# Altium project iMX6 Rex_V1I1.PrjPcb (part 5 of 5)

## Sheet [16] - PWR 2V5, 1V5.SchDoc
size A2; DocumentNumber: 16; SheetNumber: 16; SheetTotal: 20
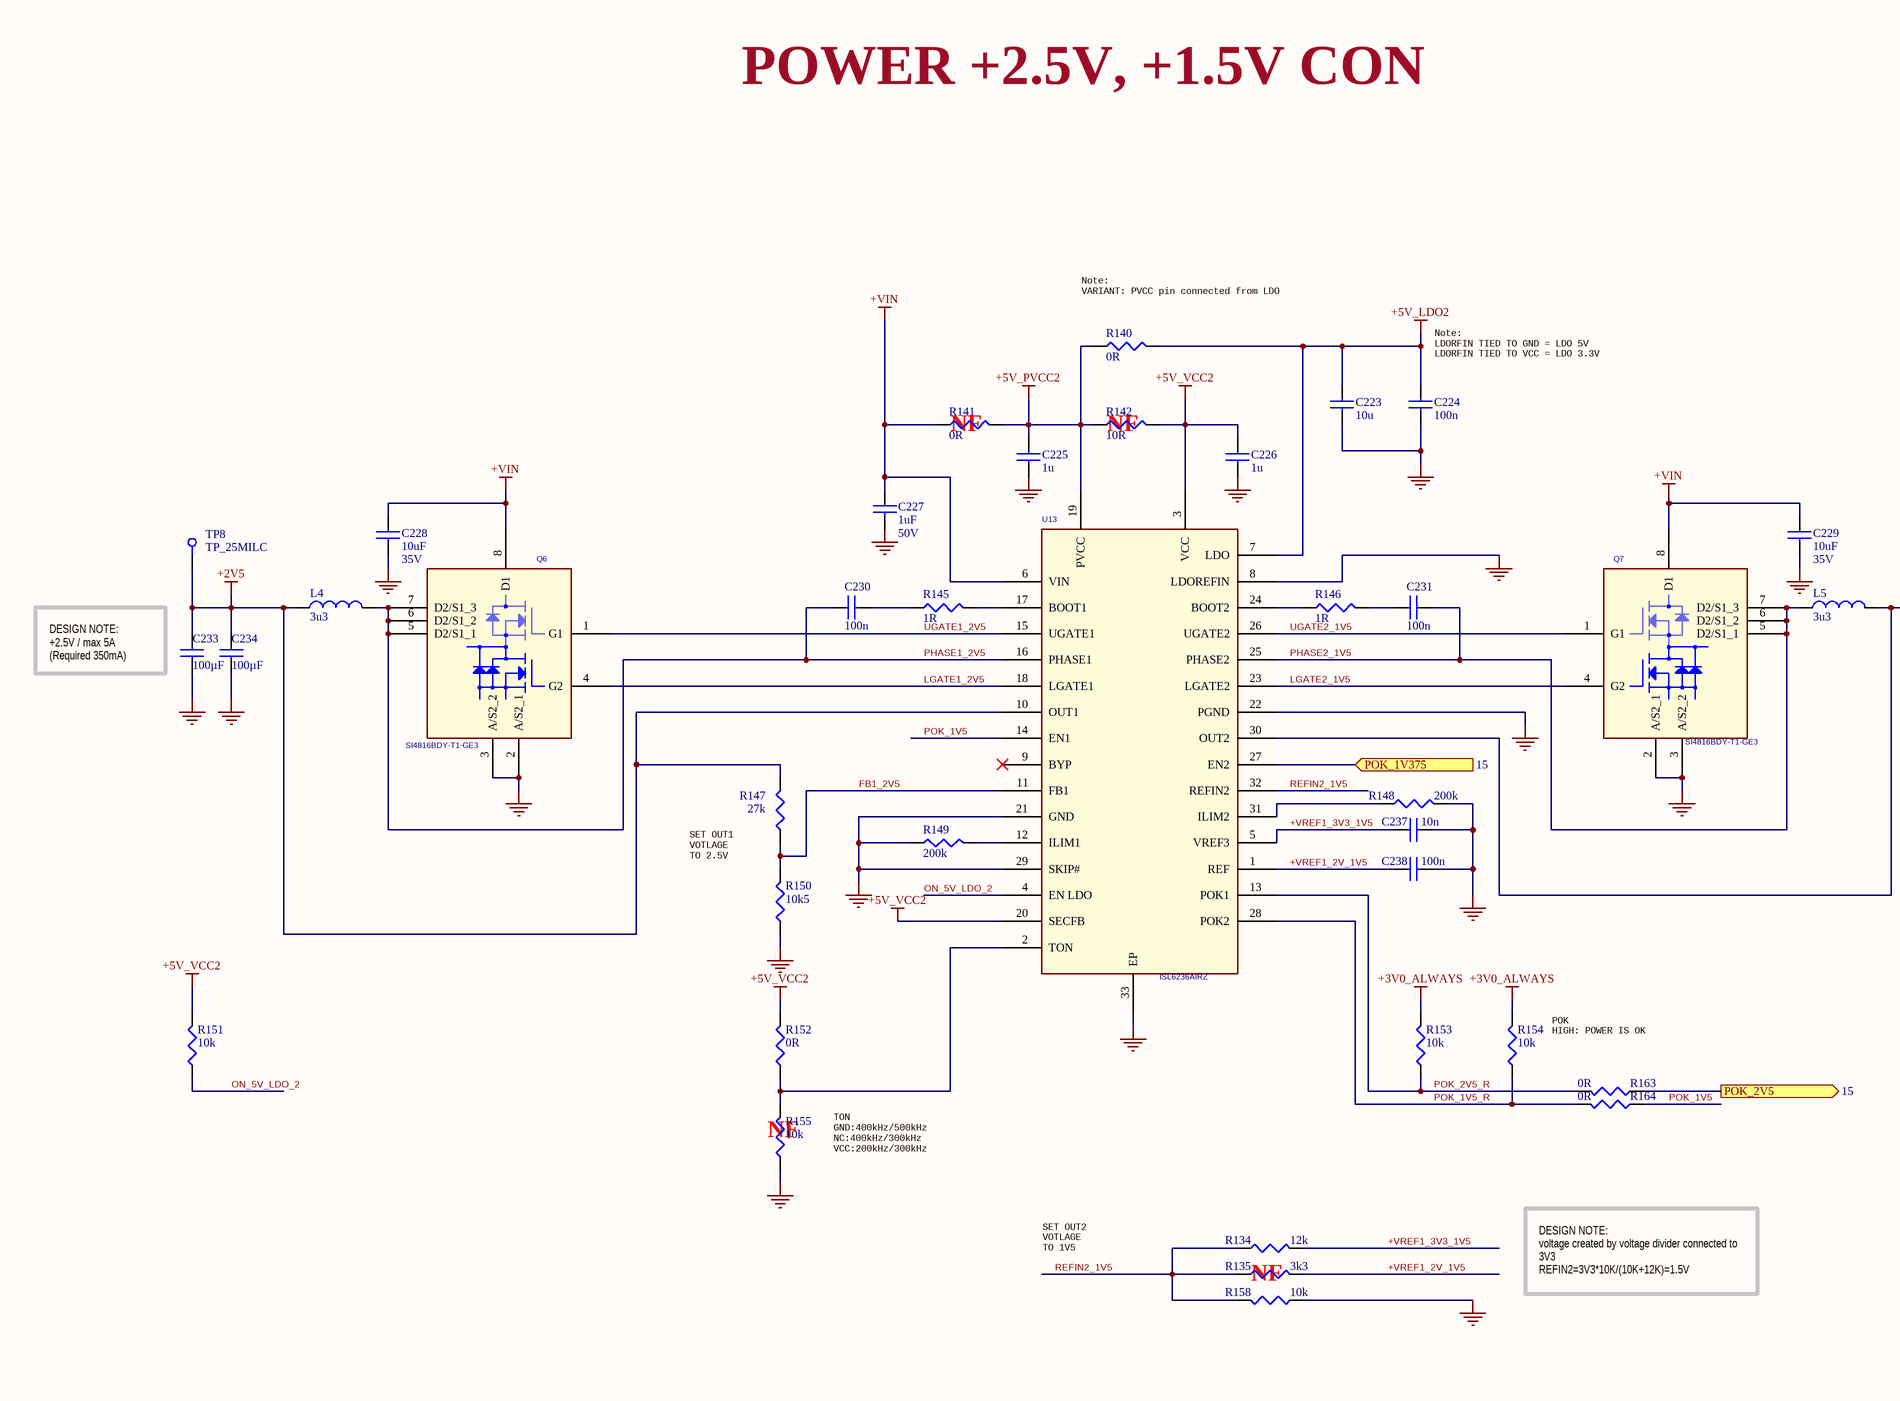
[diagram p18: [16] - PWR 2V5, 1V5.SchDoc, left]
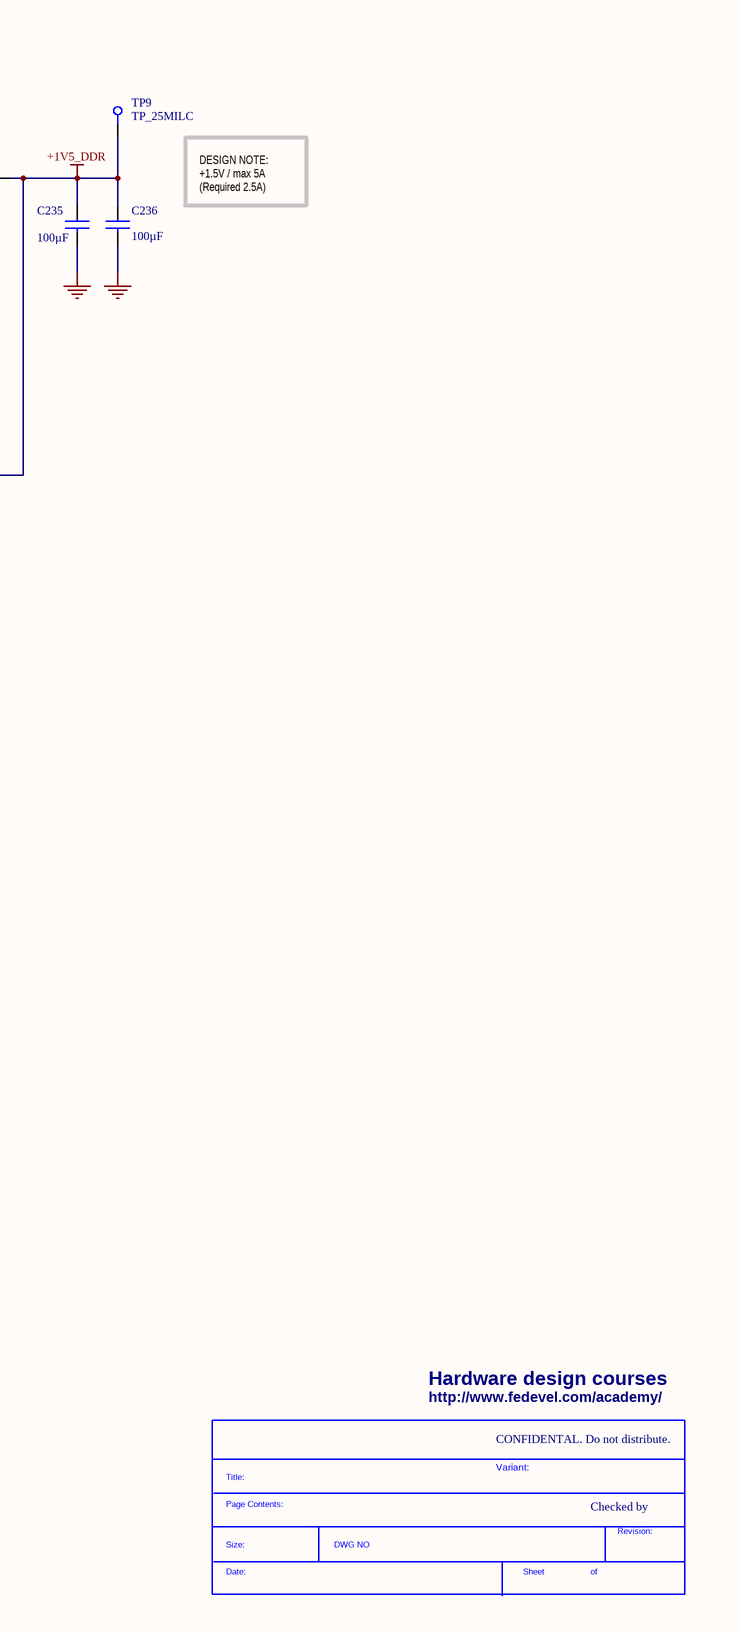
[diagram p19: [16] - PWR 2V5, 1V5.SchDoc, right]

### Parts
(Parts that share a designator on the sheet are numbered #1, #2 ... from top to bottom, then left to right.)
*#11  SDTitleBlock  (value not drawn)  (graphical)
C223  10u  [C0603]
C224  100n  [C0402]
C225  1u  [C0402]
C226  1u  [C0402]
C227  1uF  Voltage - Rated: 50V  [C0805]
C228  10uF  Voltage - Rated: 35V  [C1206]
C229  10uF  Voltage - Rated: 35V  [C1206]
C230  100n  [C0402]
C231  100n  [C0402]
C233  100µF  [C1206]
C234  100µF  [C1206]
C235  100µF  [C1206]
C236  100µF  [C1206]
C237  10n  [C0402]
C238  100n  [C0402]
L4  3u3  [IHLP_255MILx270MIL]
L5  3u3  [IHLP_255MILx270MIL]
Q6  SI4816BDY-T1-GE3  [8_SOIC_3.9MM]
Q7  SI4816BDY-T1-GE3  [8_SOIC_3.9MM]
R134  12k  [R0402]
R135  3k3  [R0402]
R140  0R  [R0402]
R141  0R  [R0402]
R142  10R  [R0402]
R145  1R  [R0402]
R146  1R  [R0402]
R147  27k  [R0402]
R148  200k  [R0402]
R149  200k  [R0402]
R150  10k5  [R0402]
R151  10k  [R0402]
R152  0R  [R0402]
R153  10k  [R0402]
R154  10k  [R0402]
R155  10k  [R0402]
R158  10k  [R0402]
R163  0R  [R0402]
R164  0R  [R0402]
TP8  TP_25MILC  [TP_25C]  (no BOM)
TP9  TP_25MILC  [TP_25C]  (no BOM)
U13  ISL6236AIRZ  [32_VFQFN_EXPOSED_PAD]

### Ports
POK_1V375 (in, see 15), POK_2V5 (out, see 15)

### Nets
+1V5_DDR: C235.1 C236.1 L5.2 TP9.1 U13.30(OUT2)
+2V5: C233.1 C234.1 L4.1 R147.2 TP8.1 U13.10(OUT1)
+3V0_ALWAYS: R153.2 R154.2
+5V_LDO2: C223.1 C224.1 R140.2 U13.7(LDO)
+5V_PVCC2: C225.1 R140.1 R141.2 R142.1 U13.19(PVCC)
+5V_VCC2: C226.1 R142.2 R151.2 R152.2 U13.3(VCC) U13.20(SECFB)
+VIN: C227.1 C228.1 C229.1 Q6.8(D1) Q7.8(D1) R141.1 U13.6(VIN)
GND: C223.2 C224.2 C225.2 C226.2 C227.2 C228.2 C229.2 C233.2 C234.2 C235.2 C236.2 C237.2 C238.2 Q6.2(A/S2_1) Q6.3(A/S2_2) Q7.2(A/S2_1) Q7.3(A/S2_2) R148.2 R149.1 R150.1 R155.1 R158.1 U13.8(LDOREFIN) U13.21(GND) U13.22(PGND) U13.29(SKIP#) U13.33(EP)
+VREF1_2V_1V5: C238.1 R135.2 U13.1(REF)
+VREF1_3V3_1V5: C237.1 R134.2 U13.5(VREF3)
FB1_2V5: R147.1 R150.2 U13.11(FB1)
LGATE1_2V5: Q6.4(G2) U13.18(LGATE1)
LGATE2_1V5: Q7.4(G2) U13.23(LGATE2)
ON_5V_LDO_2: R151.1 U13.4(EN_LDO)
PHASE1_2V5: C230.1 L4.2 Q6.5(D2/S1_1) Q6.6(D2/S1_2) Q6.7(D2/S1_3) U13.16(PHASE1)
PHASE2_1V5: C231.2 L5.1 Q7.5(D2/S1_1) Q7.6(D2/S1_2) Q7.7(D2/S1_3) U13.25(PHASE2)
POK_1V5: R164.1 U13.14(EN1)
POK_1V5_R: R154.1 R164.2 U13.28(POK2)
POK_1V375: U13.27(EN2) ; port POK_1V375
POK_2V5: R163.1 ; port POK_2V5
POK_2V5_R: R153.1 R163.2 U13.13(POK1)
REFIN2_1V5: R134.1 R135.1 R158.2 U13.32(REFIN2)
UGATE1_2V5: Q6.1(G1) U13.15(UGATE1)
UGATE2_1V5: Q7.1(G1) U13.26(UGATE2)
NetC230_2: C230.2 R145.1
NetC231_1: C231.1 R146.2
NetR145_2: R145.2 U13.17(BOOT1)
NetR146_1: R146.1 U13.24(BOOT2)
NetR148_1: R148.1 U13.31(ILIM2)
NetR149_2: R149.2 U13.12(ILIM1)
NetR152_1: R152.1 R155.2 U13.2(TON)

Not connected (* = marked no-connect by the designer): U13 9(BYP)*

### Notes on the sheet
- POWER +2.5V, +1.5V CON
- (near R140) Note:
  VARIANT: PVCC pin connected from LDO
- (near C224) Note:
  LDORFIN TIED TO GND = LDO 5V
  LDORFIN TIED TO VCC = LDO 3.3V
- (near R141) NF
- (near R142) NF
- (near C233) DESIGN NOTE:
  +2.5V / max 5A
  (Required 350mA)
- DESIGN NOTE:
  +1.5V / max 5A
  (Required 2.5A)
- SET OUT1
  VOTLAGE
  TO 2.5V
- POK
  HIGH: POWER IS OK
- (near R155) NF
- TON
  GND:400kHz/500kHz
  NC:400kHz/300kHz
  VCC:200kHz/300kHz
- SET OUT2
  VOTLAGE
  TO 1V5
- (near R135) NF
- DESIGN NOTE:
  voltage created by voltage divider connected to 3V3
  REFIN2=3V3*10K/(10K+12K)=1.5V
- Hardware design courses
- http://www.fedevel.com/academy/
- CONFIDENTAL. Do not distribute.
- Variant:
- Checked by
- (in symbol SDTitleBlock) Title:; Page Contents:; Revision:; Size:; DWG NO; Date:; Sheet; of

### Library data of the parts
C223 = C1608X5R0J106M: CAP CER 10UF 6.3V X5R 20% 0603; Manufacturer: TDK Corporation; Capacitance: 10µF; Value: 10µF; .Checked PCB: used; Description: CAP CER 10UF 6.3V 20% X5R 0603; Category: Capacitors; Manufacturer Part Number: C1608X5R0J106M; Operating Temperature: -55°C ~ 85°C; Package / Case: 0603 (1608 Metric); Price 1k [$]: 0.08580; .Checked SCH: used; Voltage - Rated: 6.3V; Features: Low ESR; Supplier Part Number: 445-4112-1-ND; Supplier: Digikey; Supplier 1: Digi-Key; Supplier Part Number 1: 445-4112-1-ND; RoHS: RoHS Compliant; Stock 1: 48157; Pricing 1: 1=0.46, 10=0.363, 100=0.1898, 250=0.14024, 500=0.1089, 1000=0.0858 (USD); Tolerance: ±20%; Temperature Coefficient: X5R; Mounting Type: Surface Mount, MLCC; Applications: General Purpose; Ratings: -; Size / Dimension: 0.063" L x 0.031" W (1.60mm x 0.80mm); Height - Seated (Max): -; Thickness (Max): 0.037" (0.95mm); Lead Spacing: -; Packaging: Cut Tape (CT); Lead Style: -; ComponentLink1URL: http://www.tdk.com/pdf/general_B11.pdf; ComponentLink1Description: http://www.tdk.com/pdf/general_B11.pdf
C224 C230 C231 C238 = C1005X5R1H104K: CAP CER .10UF 50V X5R 10% 0402; Manufacturer: TDK Corporation; Capacitance: 0.1µF; Value: 100nF; .Checked PCB: used; Description: CAP CER 0.1UF 50V 10% X5R 0402; Category: Capacitors; Manufacturer Part Number: C1005X5R1H104K; Operating Temperature: -55°C ~ 85°C; Package / Case: 0402 (1005 Metric); Price 1k [$]: 0.02340; .Checked SCH: used; Voltage - Rated: 50V; Supplier Part Number: 445-5942-1-ND; Supplier: Digikey; Supplier 1: Digi-Key; Supplier Part Number 1: 445-5942-1-ND; RoHS: RoHS Compliant; Stock 1: 106926; Pricing 1: 1=0.27, 10=0.18, 100=0.072, 250=0.05176, 500=0.0369, 1000=0.027 (USD); Tolerance: ±10%; Temperature Coefficient: X5R; Mounting Type: Surface Mount, MLCC; Applications: General Purpose; Ratings: -; Size / Dimension: 0.039" L x 0.020" W (1.00mm x 0.50mm); Height - Seated (Max): -; Thickness (Max): 0.022" (0.55mm); Lead Spacing: -; Features: -; Packaging: Cut Tape (CT); Lead Style: -; ComponentLink1URL: http://www.tdk.co.jp/tefe02/e412_c.pdf; ComponentLink1Description: http://www.tdk.co.jp/tefe02/e412_c.pdf
C225 C226 = C1005X5R1C105K: CAP CER 1.0UF 16V X5R 0402; Manufacturer: TDK Corporation; Capacitance: 1.0µF; Value: 1uF; .Checked PCB: used; Description: CAP CER 1UF 16V 10% X5R 0402; Tolerance: ±10%; Category: Capacitors; Manufacturer Part Number: C1005X5R1C105K; Operating Temperature: -55°C ~ 85°C; Package / Case: 0402 (1005 Metric); Price 1k [$]: 0.02080; .Checked SCH: used; Voltage - Rated: 16V; Supplier Part Number: 445-4978-1-ND; Supplier: Digikey; Supplier 1: Digi-Key; Supplier Part Number 1: 445-4978-1-ND; RoHS: RoHS Compliant; Stock 1: 341010; Pricing 1: 1=0.24, 10=0.16, 100=0.064, 250=0.046, 500=0.0328, 1000=0.024 (USD); Temperature Coefficient: X5R; Mounting Type: Surface Mount, MLCC; Applications: General Purpose; Ratings: -; Size / Dimension: 0.039" L x 0.020" W (1.00mm x 0.50mm); Height - Seated (Max): -; Thickness (Max): 0.022" (0.55mm); Lead Spacing: -; Features: -; Packaging: Cut Tape (CT); Lead Style: -; ComponentLink1URL: http://www.tdk.co.jp/tefe02/e412_c.pdf; ComponentLink1Description: http://www.tdk.co.jp/tefe02/e412_c.pdf
C227 = GRM21BR71H105KA12L: CAP CER 1UF 50V X7R 0805; Manufacturer: Murata Electronics North America; Capacitance: 1.0µF; .Checked PCB: used; Description: CAP CER 1UF 50V 10% X7R 0805; Tolerance: ±10%; Category: Capacitors; Manufacturer Part Number: GRM21BR71H105KA12L; Operating Temperature: -55°C ~ 125°C; Package / Case: 0805 (2012 Metric); Price 1k [$]: 0.1359; Value: 1uF; .Checked SCH: used; Supplier Part Number: 490-4736-1-ND; Supplier: Digikey; Supplier 1: Digi-Key; Supplier Part Number 1: 490-4736-1-ND; RoHS: RoHS Compliant; Stock 1: 422791; Pricing 1: 1=0.28, 10=0.254, 25=0.226, 50=0.1978, 100=0.1836, 250=0.16952, 500=0.16102, 750=0.14691, 1000=0.12995 (USD); Temperature Coefficient: X7R; Mounting Type: Surface Mount, MLCC; Applications: General Purpose; Ratings: -; Size / Dimension: 0.079" L x 0.049" W (2.00mm x 1.25mm); Height - Seated (Max): -; Thickness (Max): 0.053" (1.35mm); Lead Spacing: -; Features: -; Packaging: Cut Tape (CT); Lead Style: -; ComponentLink1URL: http://search.murata.co.jp/Ceramy/image/img/PDF/ENG/GRM21BR71H105KA12.pdf; ComponentLink1Description: http://search.murata.co.jp/Ceramy/image/img/PDF/ENG/GRM21BR71H105KA12.pdf
C228 C229 = GRM31CR6YA106KA12L: CAP CER 10UF 35V X5R 1206; Manufacturer: Murata Electronics North America; Capacitance: 10µF; .Checked PCB: used; Description: CAP CER 10UF 35V 10% X5R 1206; Tolerance: ±10%; Category: Capacitors; Manufacturer Part Number: GRM31CR6YA106KA12L; Operating Temperature: -55°C ~ 85°C; Package / Case: 1206 (3216 Metric); Price 1k [$]: 0.19448; Value: 10uF; .Checked SCH: used; Supplier Part Number: 490-5524-1-ND; Supplier: Digikey; Supplier 1: Digi-Key; Supplier Part Number 1: 490-5524-1-ND; RoHS: RoHS Compliant; Stock 1: 76334; Pricing 1: 1=0.6, 10=0.501, 50=0.359, 100=0.3142, 250=0.24684, 500=0.2244, 1000=0.17952 (USD); Temperature Coefficient: X5R; Mounting Type: Surface Mount, MLCC; Applications: General Purpose; Ratings: -; Size / Dimension: 0.126" L x 0.063" W (3.20mm x 1.60mm); Height - Seated (Max): -; Thickness (Max): 0.071" (1.80mm); Lead Spacing: -; Features: -; Packaging: Cut Tape (CT); Lead Style: -; ComponentLink1URL: http://www.murata.com/products/catalog/pdf/c02e.pdf; ComponentLink1Description: http://www.murata.com/products/catalog/pdf/c02e.pdf
C233-C236 = C3216X5R1A107M: CAP CER 100UF 10V X5R 20% 1206; Manufacturer: TDK Corporation; .Checked PCB: used; Description: CAP CER 100UF 10V 20% X5R 1206; Capacitance: 100µF; Category: Capacitors; Manufacturer Part Number: C3216X5R1A107M; Operating Temperature: -55°C ~ 85°C; Package / Case: 1206 (3216 Metric); Price 1k [$]: 0.85800; Value: 100µF; .Checked SCH: used; Voltage - Rated: 10V; Supplier Part Number: 445-6007-1-ND; Supplier: Digikey; Supplier 1: Digi-Key; Supplier Part Number 1: 445-6007-1-ND; RoHS: RoHS Compliant; Stock 1: 28026; Pricing 1: 1=1.65, 10=1.353, 100=1.089, 250=0.957, 500=0.891, 1000=0.693 (USD); Tolerance: ±20%; Temperature Coefficient: X5R; Mounting Type: Surface Mount, MLCC; Applications: General Purpose; Ratings: -; Size / Dimension: 0.126" L x 0.063" W (3.20mm x 1.60mm); Height - Seated (Max): -; Thickness (Max): 0.071" (1.80mm); Lead Spacing: -; Features: -; Packaging: Cut Tape (CT); Lead Style: -; ComponentLink1URL: http://www.tdk.com/pdf/general_B11.pdf; ComponentLink1Description: http://www.tdk.com/pdf/general_B11.pdf
C237 = C1005X7R1C103K: CAP CER 10000PF 16V X7R 10% 0402; Manufacturer: TDK Corporation; Value: 10nF; .Checked PCB: used; Description: CAP CER 10000PF 16V 10% X7R 0402; Capacitance: 10000pF; Category: Capacitors; Manufacturer Part Number: C1005X7R1C103K; Operating Temperature: -55°C ~ 125°C; Package / Case: 0402 (1005 Metric); Price 1k [$]: 0.00416; .Checked SCH: used; Voltage - Rated: 16V; Supplier Part Number: 445-1262-1-ND; Supplier: Digikey; Supplier 1: Digi-Key; Supplier Part Number 1: 445-1262-1-ND; RoHS: RoHS Compliant; Stock 1: 511497; Pricing 1: 1=0.08, 10=0.05, 100=0.018, 250=0.013, 500=0.0096, 1000=0.0065 (USD); Tolerance: ±10%; Temperature Coefficient: X7R; Mounting Type: Surface Mount, MLCC; Applications: General Purpose; Ratings: -; Size / Dimension: 0.039" L x 0.020" W (1.00mm x 0.50mm); Height - Seated (Max): -; Thickness (Max): 0.022" (0.55mm); Lead Spacing: -; Features: -; Packaging: Cut Tape (CT); Lead Style: -; ComponentLink1URL: http://www.tdk.co.jp/tefe02/e412_c.pdf; ComponentLink1Description: http://www.tdk.co.jp/tefe02/e412_c.pdf
L4 L5 = IHLP2525CZER3R3M01: INDUCTOR POWER 3.3UH 6A SMD; Manufacturer: Vishay Dale; Inductance: 3.3µH; Current - Saturation: 13.5A; Tolerance: ±20%; Shielding: Shielded; DC Resistance (DCR): 30 mOhm Max; Frequency - Test: 100kHz; .Checked PCB: RF; Supplier 1: Digi-Key; Supplier Part Number 1: 541-1009-1-ND; Manufacturer Part Number: IHLP2525CZER3R3M01; RoHS: RoHS Compliant; Category: Inductors, Coils, Chokes; Stock 1: 20795; Pricing 1: 1=2.26, 10=1.83, 100=1.525, 500=1.22, 1000=1.098 (USD); Current: 6A; Current - Temperature Rise: 6A; Type: -; Q @ Freq: -; Frequency - Self Resonant: -; Applications: General Purpose; Material - Core: -; Package / Case: 0.270" L x 0.255" W x 0.118" H (6.86mm x 6.47mm x 3.00mm); Mounting Type: Surface Mount; Packaging: Cut Tape (CT); Operating Temperature: -55°C ~ 125°C; ComponentLink1URL: http://www.vishay.com/doc?34104; ComponentLink1Description: http://www.vishay.com/doc?34104; .Checked SCH: RF
Q6 Q7 = SI4816BDY-T1-GE3: MOSFET DL N-CH 30V 6.8A 8-SOIC; Manufacturer: Vishay/Siliconix; .Checked PCB: used; FET Type: 2 N-Channel (Dual); FET Feature: Logic Level Gate; Rds On (Max) @ Id, Vgs: 18.5 mOhm @ 6.8A, 10V; Current - Continuous Drain (Id) @ 25° C: 5.8A, 8.2A; Vgs(th) (Max) @ Id: 3V @ 250µA; Power - Max: 1W, 1.25W; Gate Charge (Qg) @ Vgs: 10nC @ 5V; .Checked SCH: used; Category: Discrete Semiconductor Products; Manufacturer Part Number: SI4816BDY-T1-GE3; Package / Case: 8-SOIC (0.154", 3.90mm Width); Price 1k [$]: 0.84800; Value: SI4816BDY-T1-GE3; Family: FETs - Arrays; Drain to Source Voltage (Vdss): 30V; Supplier Part Number: SI4816BDY-T1-GE3CT-ND; Supplier: Digikey; Supplier 1: Digi-Key; Supplier Part Number 1: SI4816BDY-T1-GE3CT-ND; RoHS: RoHS Compliant; Stock 1: 15735; Pricing 1: 1=1.84, 25=1.4228, 100=1.2912, 250=1.1594, 500=1.0013, 1000=0.8432 (USD); Input Capacitance (Ciss) @ Vds: -; Mounting Type: Surface Mount; Supplier Device Package: 8-SOICN; Packaging: Cut Tape (CT); ComponentLink1URL: http://www.vishay.com/docs/73026/si4816bd.pdf; ComponentLink1Description: http://www.vishay.com/docs/73026/si4816bd.pdf
R134 = RC0402FR-0712KL: RES 12.0K OHM 1/16W 1% 0402 SMD; Manufacturer: Yageo; Power (Watts): 0.063W, 1/16W; .Checked PCB: used; Temperature Coefficient: ±100ppm/°C; Category: Resistors; Supplier Part Number: 311-12.0KLRCT-ND; Manufacturer Part Number: RC0402FR-0712KL; Package / Case: 0402 (1005 Metric); Price 1k [$]: 0.01421; Resistance (Ohms): 12K; Tolerance: ±1%; Value: 12k; .Checked SCH: used; Supplier: Digikey; Supplier 1: Digi-Key; Supplier Part Number 1: 311-12.0KLRCT-ND; RoHS: RoHS Compliant; Stock 1: 526086; Pricing 1: 10=0.014, 50=0.0104, 100=0.0079, 250=0.00584, 500=0.00432, 1000=0.00288 (USD); Composition: Thick Film; Features: -; Size / Dimension: 0.039" L x 0.020" W (1.00mm x 0.50mm); Height: 0.016" (0.40mm); Number of Terminations: 2; Packaging: Cut Tape (CT); ComponentLink1URL: http://www.yageo.com/documents/recent/PYu-RC0402_51_RoHS_L_6.pdf; ComponentLink1Description: http://www.yageo.com/documents/recent/PYu-RC0402_51_RoHS_L_6.pdf
R135 = RC0402FR-073K3L: RES 3.30K OHM 1/16W 1% 0402 SMD; Manufacturer: Yageo; Resistance (Ohms): 3.3K; Power (Watts): 0.063W, 1/16W; .Checked PCB: used; Temperature Coefficient: ±100ppm/°C; Category: Resistors; Supplier Part Number: 311-3.30KLRCT-ND; Manufacturer Part Number: RC0402FR-073K3L; Package / Case: 0402 (1005 Metric); Price 1k [$]: 0.01421; Tolerance: ±1%; Value: 3k3; .Checked SCH: used; Supplier: Digikey; Supplier 1: Digi-Key; Supplier Part Number 1: 311-3.30KLRCT-ND; RoHS: RoHS Compliant; Stock 1: 356340; Pricing 1: 10=0.014, 50=0.0104, 100=0.0079, 250=0.00584, 500=0.00432, 1000=0.00288 (USD); Composition: Thick Film; Features: -; Size / Dimension: 0.039" L x 0.020" W (1.00mm x 0.50mm); Height: 0.016" (0.40mm); Number of Terminations: 2; Packaging: Cut Tape (CT); ComponentLink1URL: http://www.yageo.com/documents/recent/PYu-RC0402_51_RoHS_L_6.pdf; ComponentLink1Description: http://www.yageo.com/documents/recent/PYu-RC0402_51_RoHS_L_6.pdf
R140 R141 R152 R163 R164 = RC0402JR-070RL: RES 0.0 OHM 1/16W 0402 SMD; Manufacturer: Yageo; Resistance (Ohms): 0.0; Power (Watts): 0.063W, 1/16W; Tolerance: Jumper; .Checked PCB: used; Category: Resistors; Manufacturer Part Number: RC0402JR-070RL; Package / Case: 0402 (1005 Metric); Price 1k [$]: 0.01389; Value: 0R; .Checked SCH: used; Supplier Part Number: 311-0.0JRCT-ND; Supplier: Digikey; Supplier 1: Digi-Key; Supplier Part Number 1: 311-0.0JRCT-ND; RoHS: RoHS Compliant; Stock 1: 1106330; Pricing 1: 10=0.012, 50=0.009, 100=0.0069, 250=0.00512, 500=0.0038, 1000=0.00253 (USD); Composition: Thick Film; Features: -; Temperature Coefficient: -; Size / Dimension: 0.039" L x 0.020" W (1.00mm x 0.50mm); Height: 0.016" (0.40mm); Number of Terminations: 2; Packaging: Cut Tape (CT); ComponentLink1URL: http://www.yageo.com/documents/recent/PYu-RC0402_51_RoHS_L_6.pdf; ComponentLink1Description: http://www.yageo.com/documents/recent/PYu-RC0402_51_RoHS_L_6.pdf
R142 = RC0402FR-0710RL: RES 10.0 OHM 1/16W 1% 0402 SMD; Manufacturer: Yageo; Resistance (Ohms): 10; Power (Watts): 0.063W, 1/16W; .Checked PCB: used; Temperature Coefficient: ±200ppm/°C; Category: Resistors; Manufacturer Part Number: RC0402FR-0710RL; Package / Case: 0402 (1005 Metric); Price 1k [$]: 0.01421; Tolerance: ±1%; Value: 10R; .Checked SCH: used; Supplier Part Number: 311-10.0LRCT-ND; Supplier: Digikey; Supplier 1: Digi-Key; Supplier Part Number 1: 311-10.0LRCT-ND; RoHS: RoHS Compliant; Stock 1: 681416; Pricing 1: 10=0.014, 50=0.0104, 100=0.0079, 250=0.00584, 500=0.00432, 1000=0.00288 (USD); Composition: Thick Film; Features: -; Size / Dimension: 0.039" L x 0.020" W (1.00mm x 0.50mm); Height: 0.016" (0.40mm); Number of Terminations: 2; Packaging: Cut Tape (CT); ComponentLink1URL: http://www.yageo.com/documents/recent/PYu-RC0402_51_RoHS_L_6.pdf; ComponentLink1Description: http://www.yageo.com/documents/recent/PYu-RC0402_51_RoHS_L_6.pdf
R145 R146 = RC0402FR-071RL: RES 1.00 OHM 1/16W 1% 0402 SM; Manufacturer: Yageo; Resistance (Ohms): 1; Power (Watts): 0.063W, 1/16W; .Checked PCB: used; Description: RES 1.00 OHM 1/16W 1% 0402 SMD; Temperature Coefficient: ±200ppm/°C; Category: Resistors; Manufacturer Part Number: RC0402FR-071RL; Package / Case: 0402 (1005 Metric); Price 1k [$]: 0.01421; Tolerance: ±1%; Value: 1R; .Checked SCH: used; Supplier Part Number: 311-1.00LRCT-ND; Supplier: Digikey; Supplier 1: Digi-Key; Supplier Part Number 1: 311-1.00LRCT-ND; RoHS: RoHS Compliant; Stock 1: 347765; Pricing 1: 10=0.019, 50=0.0142, 100=0.0109, 250=0.00808, 500=0.00596, 1000=0.00397 (USD); Composition: Thick Film; Features: -; Size / Dimension: 0.039" L x 0.020" W (1.00mm x 0.50mm); Height: 0.016" (0.40mm); Number of Terminations: 2; Packaging: Cut Tape (CT); ComponentLink1URL: http://www.yageo.com/documents/recent/PYu-RC0402_51_RoHS_L_6.pdf; ComponentLink1Description: http://www.yageo.com/documents/recent/PYu-RC0402_51_RoHS_L_6.pdf
R147 = RC0402FR-0727KL: RES 27.0K OHM 1/16W 1% 0402 SMD; Manufacturer: Yageo; Power (Watts): 0.063W, 1/16W; .Checked PCB: RF; Temperature Coefficient: ±100ppm/°C; Category: Resistors; Supplier Part Number: 311-27.0KLRCT-ND; Manufacturer Part Number: RC0402FR-0727KL; Package / Case: 0402 (1005 Metric); Price 1k [$]: 0.00288; Resistance (Ohms): 27K; Tolerance: ±1%; Value: 27k; .Checked SCH: RF; Supplier: Digikey; Supplier 1: Digi-Key; Supplier Part Number 1: 311-27.0KLRCT-ND; RoHS: RoHS Compliant; Stock 1: 21638; Pricing 1: 10=0.014, 50=0.0104, 100=0.0079, 250=0.00584, 500=0.00432, 1000=0.00288 (USD); Composition: Thick Film; Features: -; Size / Dimension: 0.039" L x 0.020" W (1.00mm x 0.50mm); Height: 0.016" (0.40mm); Number of Terminations: 2; Packaging: Cut Tape (CT); ComponentLink1URL: http://www.yageo.com/documents/recent/PYu-RC0402_51_RoHS_L_6.pdf; ComponentLink1Description: http://www.yageo.com/documents/recent/PYu-RC0402_51_RoHS_L_6.pdf
R148 R149 = RC0402FR-07200KL: RES 200K OHM 1/16W 1% 0402 SMD; Manufacturer: Yageo; Power (Watts): 0.063W, 1/16W; .Checked PCB: used; Temperature Coefficient: ±100ppm/°C; Category: Resistors; Manufacturer Part Number: RC0402FR-07200KL; Package / Case: 0402 (1005 Metric); Price 1k [$]: 0.01421; Resistance (Ohms): 200K; Tolerance: ±1%; Value: 200k; .Checked SCH: used; Supplier Part Number: 311-200KLRCT-ND; Supplier: Digikey; Supplier 1: Digi-Key; Supplier Part Number 1: 311-200KLRCT-ND; RoHS: RoHS Compliant; Stock 1: 225869; Pricing 1: 10=0.014, 50=0.0104, 100=0.0079, 250=0.00584, 500=0.00432, 1000=0.00288 (USD); Composition: Thick Film; Features: -; Size / Dimension: 0.039" L x 0.020" W (1.00mm x 0.50mm); Height: 0.016" (0.40mm); Number of Terminations: 2; Packaging: Cut Tape (CT); ComponentLink1URL: http://www.yageo.com/documents/recent/PYu-RC0402_51_RoHS_L_6.pdf; ComponentLink1Description: http://www.yageo.com/documents/recent/PYu-RC0402_51_RoHS_L_6.pdf
R150 = CRCW040210K5FKED: RES 10.5K OHM 1/16W 1% 0402 SMD; Manufacturer: Vishay/Dale; Power (Watts): 0.063W, 1/16W; .Checked PCB: used; Temperature Coefficient: ±100ppm/°C; Category: Resistors; Manufacturer Part Number: CRCW040210K5FKED; Package / Case: 0402 (1005 Metric); Price 1k [$]: 0.01740; Resistance (Ohms): 10.5K; Tolerance: ±1%; Value: 10k5; .Checked SCH: used; Supplier Part Number: 541-10.5KLCT-ND; Supplier: Digikey; Supplier 1: Digi-Key; Supplier Part Number 1: 541-10.5KLCT-ND; RoHS: RoHS Compliant; Stock 1: 36157; Pricing 1: 10=0.083, 50=0.0444, 200=0.0255, 1000=0.0174 (USD); Composition: Thick Film; Features: -; Size / Dimension: 0.039" L x 0.020" W (1.00mm x 0.50mm); Height: 0.016" (0.40mm); Number of Terminations: 2; Packaging: Cut Tape (CT); ComponentLink1URL: http://www.vishay.com/doc?20035; ComponentLink1Description: http://www.vishay.com/doc?20035
R151 R153-R155 R158 = RC0402FR-0710KL: RES 10.0K OHM 1/16W 1% 0402 SMD; Manufacturer: Yageo; Power (Watts): 0.063W, 1/16W; .Checked PCB: used; Temperature Coefficient: ±100ppm/°C; Category: Resistors; Manufacturer Part Number: RC0402FR-0710KL; Package / Case: 0402 (1005 Metric); Price 1k [$]: 0.01421; Resistance (Ohms): 10K; Tolerance: ±1%; Value: 10k; .Checked SCH: used; Supplier Part Number: 311-10.0KLRCT-ND; Supplier: Digikey; Supplier 1: Digi-Key; Supplier Part Number 1: 311-10.0KLRCT-ND; RoHS: RoHS Compliant; Stock 1: 2916495; Pricing 1: 10=0.014, 50=0.0104, 100=0.0079, 250=0.00584, 500=0.00432, 1000=0.00288 (USD); Composition: Thick Film; Features: -; Size / Dimension: 0.039" L x 0.020" W (1.00mm x 0.50mm); Height: 0.016" (0.40mm); Number of Terminations: 2; Packaging: Cut Tape (CT); ComponentLink1URL: http://www.yageo.com/documents/recent/PYu-RC0402_51_RoHS_L_6.pdf; ComponentLink1Description: http://www.yageo.com/documents/recent/PYu-RC0402_51_RoHS_L_6.pdf
TP8 TP9 = TP_25MILC: Test Point 25mil
U13 = ISL6236AIRZ: IC MAIN PWR CTRLR QUAD 32-QFN; Manufacturer: Intersil; .Checked PCB: used; Voltage - Input: 4.5 V ~ 25 V; Number of Outputs: 4; Voltage - Output: Multiple; .Checked SCH: used; Category: Integrated Circuits (ICs); Manufacturer Part Number: ISL6236AIRZ; Operating Temperature: -40°C ~ 100°C; Package / Case: 32-VFQFN Exposed Pad; Price 1k [$]: 3.0840; Value: ISL6236AIRZ; Family: PMIC - Voltage Regulators - Special Purpose; Supplier Part Number: ISL6236AIRZ-ND; Supplier: Digikey; Supplier 1: Digi-Key; Supplier Part Number 1: ISL6236AIRZ-ND; RoHS: RoHS Compliant; Stock 1: 0; Pricing 1: 600=4.28 (USD); Applications: Controller, Notebook Power System; Mounting Type: Surface Mount; Supplier Device Package: 32-QFN Exposed Pad (5x5); Packaging: Tube; ComponentLink1URL: http://www.intersil.com/data/fn/fn6453.pdf; ComponentLink1Description: http://www.intersil.com/data/fn/fn6453.pdf

## Sheet [17] - MECH.SchDoc
size A2; DocumentNumber: 17; SheetNumber: 17; SheetTotal: 20
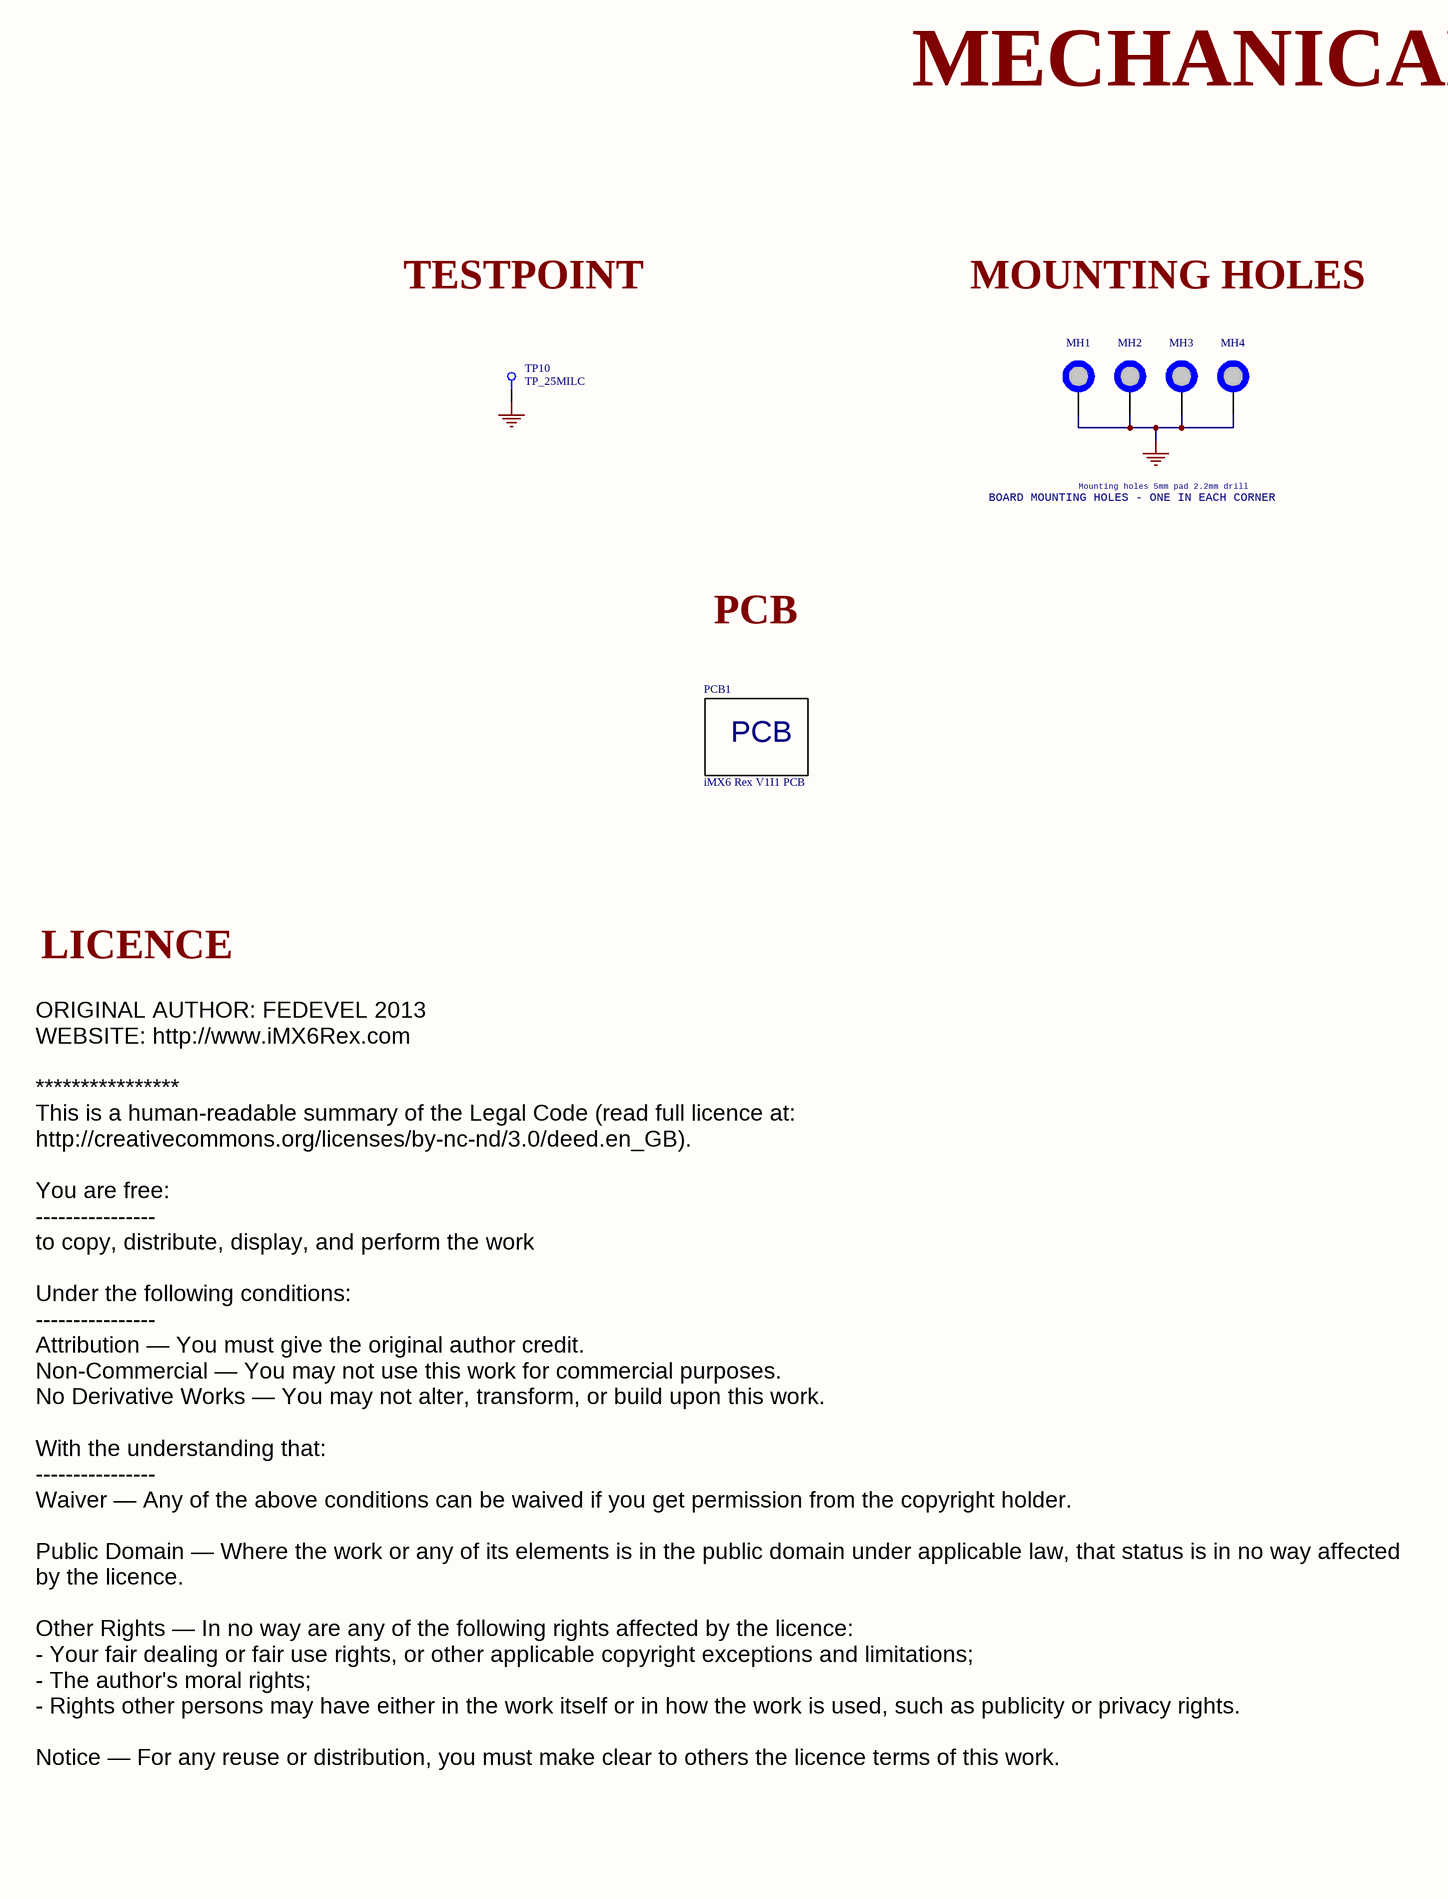
[diagram p20: [17] - MECH.SchDoc, left]
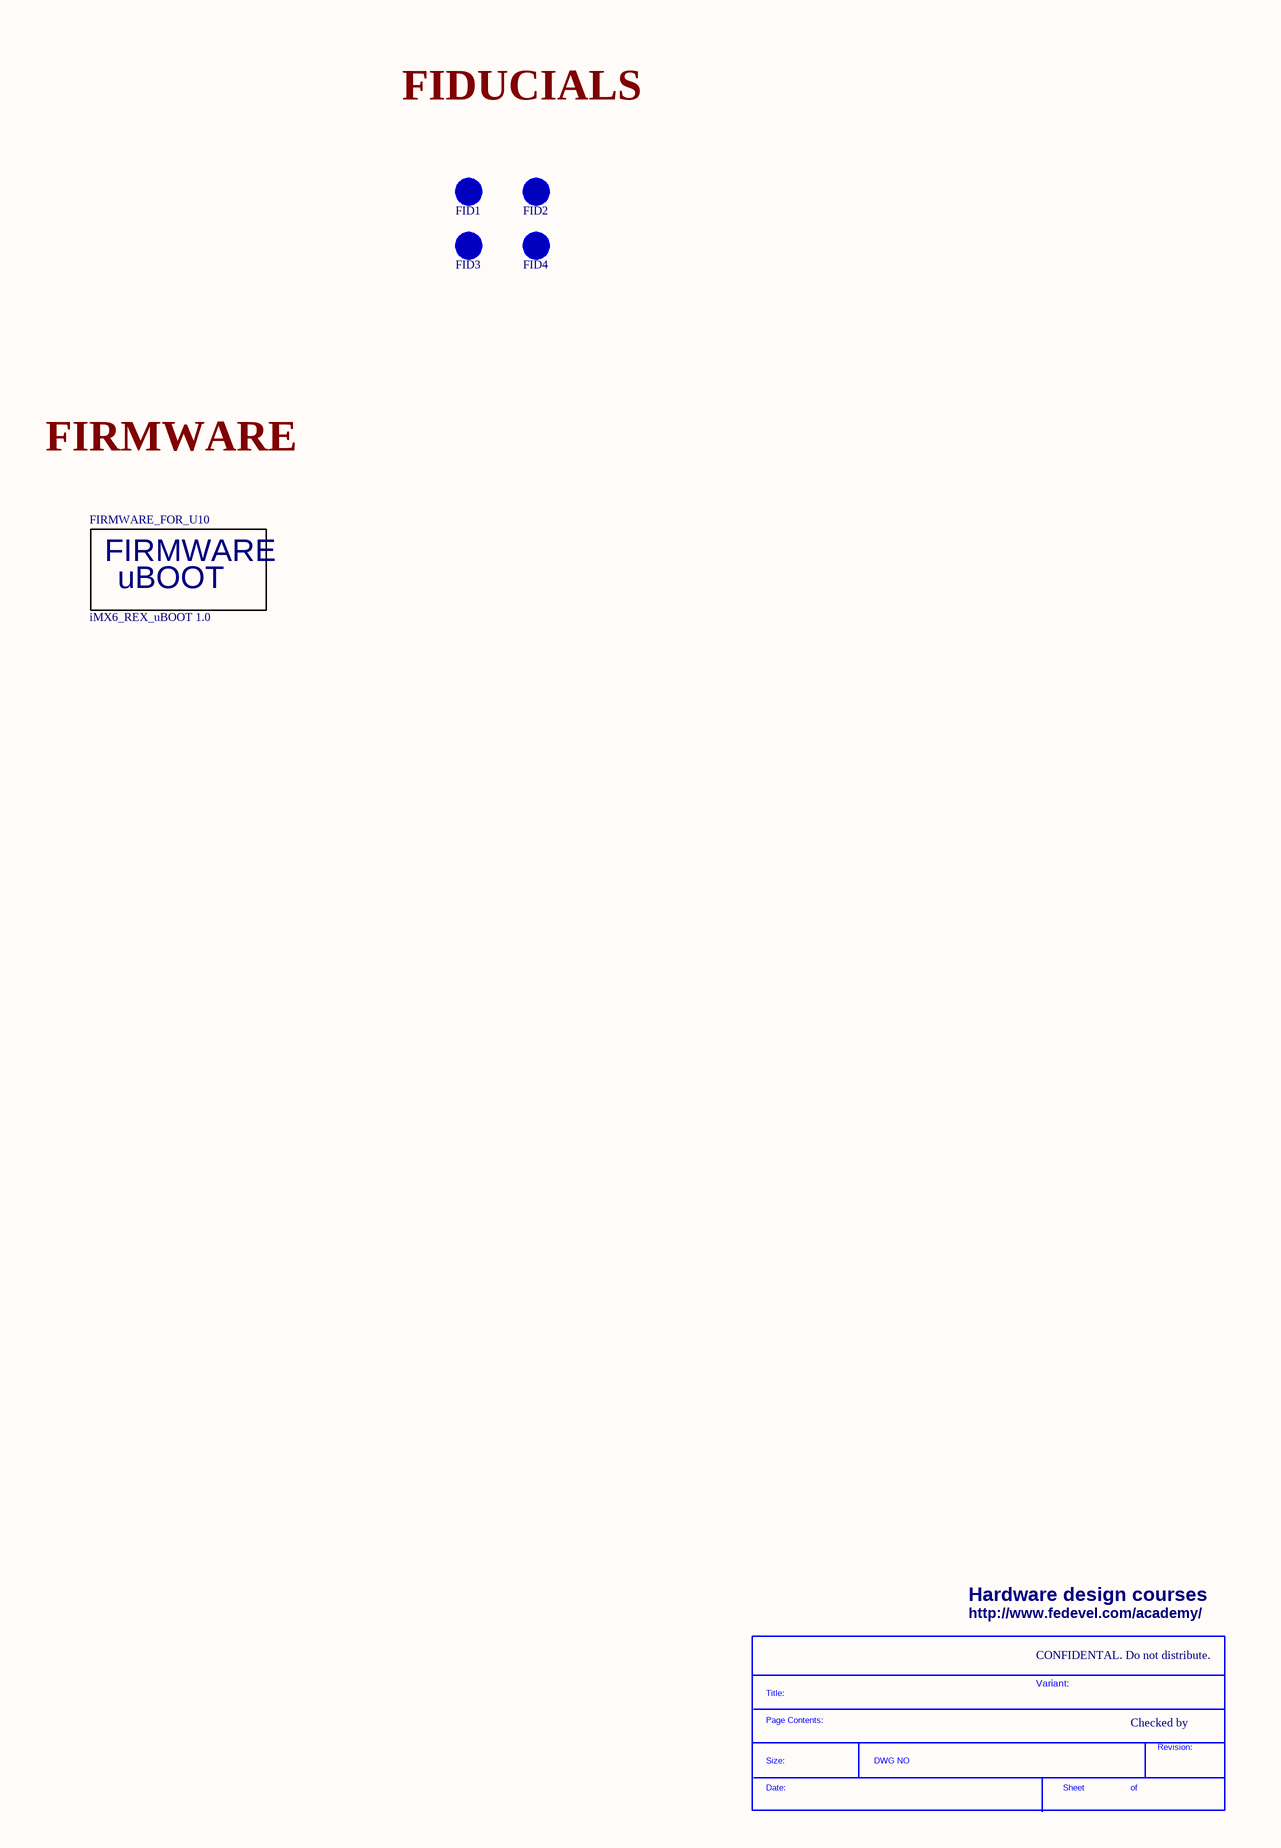
[diagram p21: [17] - MECH.SchDoc, right]

### Parts
(Parts that share a designator on the sheet are numbered #1, #2 ... from top to bottom, then left to right.)
*#12  SDTitleBlock  (value not drawn)  (graphical)
FID1  FID_1MM_SMALL  [FID_40X52D]  (value not drawn)  (no BOM)
FID2  FID_1MM_SMALL  [FID_40X52D]  (value not drawn)  (no BOM)
FID3  FID_1MM_SMALL  [FID_40X52D]  (value not drawn)  (no BOM)
FID4  FID_1MM_SMALL  [FID_40X52D]  (value not drawn)  (no BOM)
FIRMWARE_FOR_U10  iMX6_REX_uBOOT 1.0  (mechanical)
MH1  MH_5MMC_2.2MMD  [MH_5MMD_2.2MMD]  (value not drawn)  (no BOM)
MH2  MH_5MMC_2.2MMD  [MH_5MMD_2.2MMD]  (value not drawn)  (no BOM)
MH3  MH_5MMC_2.2MMD  [MH_5MMD_2.2MMD]  (value not drawn)  (no BOM)
MH4  MH_5MMC_2.2MMD  [MH_5MMD_2.2MMD]  (value not drawn)  (no BOM)
PCB1  iMX6 Rex V1I1 PCB  (mechanical)
TP10  TP_25MILC  [TP_25C]  (no BOM)

### Nets
GND: MH1.1 MH2.1 MH3.1 MH4.1 TP10.1

### Notes on the sheet
- MECHANICAL
- TESTPOINT
- MOUNTING HOLES
- FIDUCIALS
- BOARD MOUNTING HOLES - ONE IN EACH CORNER
- Mounting holes 5mm pad 2.2mm drill
- PCB
- FIRMWARE
- LICENCE
- Hardware design courses
- http://www.fedevel.com/academy/
- CONFIDENTAL. Do not distribute.
- ORIGINAL AUTHOR: FEDEVEL 2013
  WEBSITE: http://www.iMX6Rex.com
  ****************
  This is a human-readable summary of the Legal Code (read full licence at:
  http://creativecommons.org/licenses/by-nc-nd/3.0/deed.en_GB).
  You are free:
  ----------------
  to copy, distribute, display, and perform the work
  Under the following conditions:
  ----------------
  Attribution — You must give the original author credit.
  Non-Commercial — You may not use this work for commercial purposes.
  No Derivative Works — You may not alter, transform, or build upon this work.
  With the understanding that:
  ----------------
  Waiver — Any of the above conditions can be waived if you get permission from the copyright holder.
  Public Domain — Where the work or any of its elements is in the public domain under applicable law, that status is in no way affected by the licence.
  Other Rights — In no way are any of the following rights affected by the licence:
  - Your fair dealing or fair use rights, or other applicable copyright exceptions and limitations;
  - The author's moral rights;
  - Rights other persons may have either in the work itself or in how the work is used, such as publicity or privacy rights.
  Notice — For any reuse or distribution, you must make clear to others the licence terms of this work.
- Variant:
- Checked by
- (in symbol FIRMWARE_iMX6_Rex_uBOOT 1.0) FIRMWARE; uBOOT
- (in symbol PCB_iMX6_REX_V1I1) PCB
- (in symbol SDTitleBlock) Title:; Page Contents:; Revision:; Size:; DWG NO; Date:; Sheet; of

### Library data of the parts
FID1-FID4 = FID_1MM_SMALL: Fiducial 40mil Diameter, 52mil Mask; Supplier: Digikey
FIRMWARE_FOR_U10 = FIRMWARE_iMX6_Rex_uBOOT 1.0: .Creator: MM; Category: Firmware
MH1-MH4 = MH_5MMC_2.2MMD: Mounting Hole 5mm Diameter, 2.2mm Drill
PCB1 = PCB_iMX6_REX_V1I1: Printed Circuit Board; .Creator: MM; Category: Printed circuits board
TP10 = TP_25MILC: Test Point 25mil

## Nets that join several sheets
+1V1_VDDSOC_CAP: [05] - CPU - PCIE, SATA (C78.1 FB1.1 R13.1 R18.1), [06] - CPU - HDMI, LVDS (C246.1 R23.1), [11] - CPU - POWER (16 pins)
+1V2_ETH: [11] - CPU - POWER (R105.2), [13] - ETHERNET PHY (11 pins)
+1V5_DDR: [10] - CPU - JTAG, CONTROL (R59.2), [11] - CPU - POWER (13 pins), [16] - PWR 2V5, 1V5 (5 pins)
+1V375: [11] - CPU - POWER (30 pins), [13] - ETHERNET PHY (FB8.2), [15] - PWR 3V3, 1V375 (6 pins)
+2V5: [05] - CPU - PCIE, SATA (C244.1 C245.1 R14.1 R19.1), [06] - CPU - HDMI, LVDS (C247.1 R27.1 R34.1), [11] - CPU - POWER (C153.1 R74.2 R78.2 R80.2), [13] - ETHERNET PHY (FB6.1), [16] - PWR 2V5, 1V5 (6 pins)
+3V0_ALWAYS: [10] - CPU - JTAG, CONTROL (9 pins), [11] - CPU - POWER (6 pins), [15] - PWR 3V3, 1V375 (8 pins), [16] - PWR 2V5, 1V5 (R153.2 R154.2)
+3V3: [06] - CPU - HDMI, LVDS (7 pins), [08] - CPU - SPI, I2C, SD, MMC (8 pins), [03] - CONNECTORS (C1.1 J2.50), [10] - CPU - JTAG, CONTROL (10 pins), [11] - CPU - POWER (21 pins), [13] - ETHERNET PHY (C177.1 FB7.1 U9.1), [15] - PWR 3V3, 1V375 (8 pins)
+VIN: [03] - CONNECTORS (9 pins), [15] - PWR 3V3, 1V375 (10 pins), [16] - PWR 2V5, 1V5 (7 pins)
GND: [05] - CPU - PCIE, SATA (12 pins), [06] - CPU - HDMI, LVDS (9 pins), [03] - CONNECTORS (16 pins), [10] - CPU - JTAG, CONTROL (18 pins), [11] - CPU - POWER (195 pins), [13] - ETHERNET PHY (39 pins), [15] - PWR 3V3, 1V375 (39 pins), [16] - PWR 2V5, 1V5 (27 pins), [17] - MECH (5 pins)
BOOT_MODE: [03] - CONNECTORS (J1.50), [10] - CPU - JTAG, CONTROL (Q9.1 R165.1)
CLK1_N: [05] - CPU - PCIE, SATA (C66.2 R17.2), [03] - CONNECTORS (J2.46)
CLK1_P: [05] - CPU - PCIE, SATA (C67.2 R16.2), [03] - CONNECTORS (J2.48)
CSPI2_CLK: [08] - CPU - SPI, I2C, SD, MMC (R159.2), [03] - CONNECTORS (J1.17)
CSPI2_CS0: [08] - CPU - SPI, I2C, SD, MMC (U1.V25), [03] - CONNECTORS (J1.19)
CSPI2_MISO: [08] - CPU - SPI, I2C, SD, MMC (U1.U24), [03] - CONNECTORS (J1.21)
CSPI2_MOSI: [08] - CPU - SPI, I2C, SD, MMC (U1.T21), [03] - CONNECTORS (J1.23)
ENET_LED_LINK: [03] - CONNECTORS (J1.56), [13] - ETHERNET PHY (R81.2)
ENET_LED_RX: [03] - CONNECTORS (J1.55), [13] - ETHERNET PHY (R82.2)
HDMI_CEC_IN: [06] - CPU - HDMI, LVDS (R22.1 R24.2 R25.2), [03] - CONNECTORS (J1.44)
HDMI_CLK_N: [06] - CPU - HDMI, LVDS (U1.J5), [03] - CONNECTORS (J1.45)
HDMI_CLK_P: [06] - CPU - HDMI, LVDS (U1.J6), [03] - CONNECTORS (J1.47)
HDMI_D0_N: [06] - CPU - HDMI, LVDS (U1.K5), [03] - CONNECTORS (J1.39)
HDMI_D0_P: [06] - CPU - HDMI, LVDS (U1.K6), [03] - CONNECTORS (J1.41)
HDMI_D1_N: [06] - CPU - HDMI, LVDS (U1.J3), [03] - CONNECTORS (J1.46)
HDMI_D1_P: [06] - CPU - HDMI, LVDS (U1.J4), [03] - CONNECTORS (J1.48)
HDMI_D2_N: [06] - CPU - HDMI, LVDS (U1.K3), [03] - CONNECTORS (J1.40)
HDMI_D2_P: [06] - CPU - HDMI, LVDS (U1.K4), [03] - CONNECTORS (J1.42)
HDMI_HPD: [06] - CPU - HDMI, LVDS (C74.2 R21.1 U1.K1), [03] - CONNECTORS (J1.43)
I2C2_SCL: [06] - CPU - HDMI, LVDS (R28.1 U1.U5), [03] - CONNECTORS (J1.36)
I2C2_SDA: [06] - CPU - HDMI, LVDS (R29.1 U1.T7), [03] - CONNECTORS (J1.38)
I2C3_SCL: [06] - CPU - HDMI, LVDS (R31.1 U1.F21), [08] - CPU - SPI, I2C, SD, MMC (R157.2), [03] - CONNECTORS (J2.19)
I2C3_SDA: [06] - CPU - HDMI, LVDS (R32.1 U1.D24), [08] - CPU - SPI, I2C, SD, MMC (R156.2), [03] - CONNECTORS (J2.17)
I2C4_SCL: [08] - CPU - SPI, I2C, SD, MMC (R45.1 R157.1 U1.E15), [03] - CONNECTORS (J1.35)
I2C4_SDA: [08] - CPU - SPI, I2C, SD, MMC (R44.1 R156.1 U1.D16), [03] - CONNECTORS (J1.37)
JTAG_nTRST: [03] - CONNECTORS (J2.41), [10] - CPU - JTAG, CONTROL (R62.1 U1.C2)
JTAG_TCK: [03] - CONNECTORS (J2.43), [10] - CPU - JTAG, CONTROL (R92.2)
JTAG_TDI: [03] - CONNECTORS (J2.47), [10] - CPU - JTAG, CONTROL (R90.2)
JTAG_TDO: [03] - CONNECTORS (J2.45), [10] - CPU - JTAG, CONTROL (R161.2)
JTAG_TMS: [03] - CONNECTORS (J2.49), [10] - CPU - JTAG, CONTROL (R64.1 U1.C3)
LVDS0_CABC: [06] - CPU - HDMI, LVDS (R33.1 U1.A17), [03] - CONNECTORS (J2.6)
LVDS0_CLK_N: [06] - CPU - HDMI, LVDS (U1.V4), [03] - CONNECTORS (J2.13)
LVDS0_CLK_P: [06] - CPU - HDMI, LVDS (U1.V3), [03] - CONNECTORS (J2.15)
LVDS0_PWM: [06] - CPU - HDMI, LVDS (U1.F18), [03] - CONNECTORS (J2.5)
LVDS0_TX0_N: [06] - CPU - HDMI, LVDS (U1.U2), [03] - CONNECTORS (J2.2)
LVDS0_TX0_P: [06] - CPU - HDMI, LVDS (U1.U1), [03] - CONNECTORS (J2.4)
LVDS0_TX1_N: [06] - CPU - HDMI, LVDS (U1.U4), [03] - CONNECTORS (J2.8)
LVDS0_TX1_P: [06] - CPU - HDMI, LVDS (U1.U3), [03] - CONNECTORS (J2.10)
LVDS0_TX2_N: [06] - CPU - HDMI, LVDS (U1.V2), [03] - CONNECTORS (J2.1)
LVDS0_TX2_P: [06] - CPU - HDMI, LVDS (U1.V1), [03] - CONNECTORS (J2.3)
LVDS0_TX3_N: [06] - CPU - HDMI, LVDS (U1.W2), [03] - CONNECTORS (J2.7)
LVDS0_TX3_P: [06] - CPU - HDMI, LVDS (U1.W1), [03] - CONNECTORS (J2.9)
ON_OFF: [03] - CONNECTORS (J1.6), [10] - CPU - JTAG, CONTROL (R48.1 U1.D12)
PCIE_RX_N: [05] - CPU - PCIE, SATA (U1.B1), [03] - CONNECTORS (J2.52)
PCIE_RX_P: [05] - CPU - PCIE, SATA (U1.B2), [03] - CONNECTORS (J2.54)
PCIE_TX_N: [05] - CPU - PCIE, SATA (C63.2), [03] - CONNECTORS (J2.51)
PCIE_TX_P: [05] - CPU - PCIE, SATA (C65.2), [03] - CONNECTORS (J2.53)
PCIE_WAKE: [05] - CPU - PCIE, SATA (U1.P3), [03] - CONNECTORS (J2.39)
PMIC_ON_REQ: [10] - CPU - JTAG, CONTROL (R73.1 U1.D11), [15] - PWR 3V3, 1V375 (Q8.1)
POK_1V375: [15] - PWR 3V3, 1V375 (R108.1), [16] - PWR 2V5, 1V5 (U13.27)
POK_2V5: [15] - PWR 3V3, 1V375 (U11.14), [16] - PWR 2V5, 1V5 (R163.1)
POK_3V3: [10] - CPU - JTAG, CONTROL (U6.3 U7.4), [13] - ETHERNET PHY (U9.9), [15] - PWR 3V3, 1V375 (R107.1)
RGMII_RSTn: [10] - CPU - JTAG, CONTROL (D1.2 R65.2), [13] - ETHERNET PHY (R75.1 U8.42)
RSTINn: [03] - CONNECTORS (J1.8), [10] - CPU - JTAG, CONTROL (R68.1 U7.1)
RSTOUTn: [03] - CONNECTORS (J1.7), [10] - CPU - JTAG, CONTROL (R51.2 R70.2)
SATA_RX_N: [05] - CPU - PCIE, SATA (C69.2), [03] - CONNECTORS (J2.58)
SATA_RX_P: [05] - CPU - PCIE, SATA (C70.2), [03] - CONNECTORS (J2.60)
SATA_TX_N: [05] - CPU - PCIE, SATA (C71.2), [03] - CONNECTORS (J2.57)
SATA_TX_P: [05] - CPU - PCIE, SATA (C72.2), [03] - CONNECTORS (J2.59)
SD2_ACT: [08] - CPU - SPI, I2C, SD, MMC (U1.T3), [03] - CONNECTORS (J2.11)
SD2_CD: [08] - CPU - SPI, I2C, SD, MMC (R42.1 U1.F16), [03] - CONNECTORS (J2.38)
SD2_CLK: [08] - CPU - SPI, I2C, SD, MMC (R66.2), [03] - CONNECTORS (J2.36)
SD2_CMD: [08] - CPU - SPI, I2C, SD, MMC (R41.1 R52.2), [03] - CONNECTORS (J2.21)
SD2_DATA0: [08] - CPU - SPI, I2C, SD, MMC (U1.A22), [03] - CONNECTORS (J2.26)
SD2_DATA1: [08] - CPU - SPI, I2C, SD, MMC (U1.E20), [03] - CONNECTORS (J2.23)
SD2_DATA2: [08] - CPU - SPI, I2C, SD, MMC (U1.A23), [03] - CONNECTORS (J2.28)
SD2_DATA3: [08] - CPU - SPI, I2C, SD, MMC (U1.B22), [03] - CONNECTORS (J2.25)
SD2_DATA4: [08] - CPU - SPI, I2C, SD, MMC (U1.A19), [03] - CONNECTORS (J2.30)
SD2_DATA5: [08] - CPU - SPI, I2C, SD, MMC (U1.B18), [03] - CONNECTORS (J2.27)
SD2_DATA6: [08] - CPU - SPI, I2C, SD, MMC (U1.E17), [03] - CONNECTORS (J2.32)
SD2_DATA7: [08] - CPU - SPI, I2C, SD, MMC (U1.C18), [03] - CONNECTORS (J2.29)
SD2_WP: [08] - CPU - SPI, I2C, SD, MMC (R43.1 U1.D17), [03] - CONNECTORS (J2.34)
SD3_CD: [08] - CPU - SPI, I2C, SD, MMC (R39.1 U1.A18), [03] - CONNECTORS (J1.34)
SD3_CLK: [08] - CPU - SPI, I2C, SD, MMC (R50.2), [03] - CONNECTORS (J1.27)
SD3_CMD: [08] - CPU - SPI, I2C, SD, MMC (R1.2 R38.1), [03] - CONNECTORS (J1.33)
SD3_DATA0: [08] - CPU - SPI, I2C, SD, MMC (U1.E14), [03] - CONNECTORS (J1.29)
SD3_DATA1: [08] - CPU - SPI, I2C, SD, MMC (U1.F14), [03] - CONNECTORS (J1.30)
SD3_DATA2: [08] - CPU - SPI, I2C, SD, MMC (U1.A15), [03] - CONNECTORS (J1.31)
SD3_DATA3: [08] - CPU - SPI, I2C, SD, MMC (U1.B15), [03] - CONNECTORS (J1.32)
SD3_WP: [08] - CPU - SPI, I2C, SD, MMC (R40.1 U1.C17), [03] - CONNECTORS (J1.25)
TRD0_N: [03] - CONNECTORS (J1.57), [13] - ETHERNET PHY (U8.3)
TRD0_P: [03] - CONNECTORS (J1.59), [13] - ETHERNET PHY (U8.2)
TRD1_N: [03] - CONNECTORS (J1.51), [13] - ETHERNET PHY (U8.6)
TRD1_P: [03] - CONNECTORS (J1.53), [13] - ETHERNET PHY (U8.5)
TRD2_N: [03] - CONNECTORS (J1.58), [13] - ETHERNET PHY (U8.8)
TRD2_P: [03] - CONNECTORS (J1.60), [13] - ETHERNET PHY (U8.7)
TRD3_N: [03] - CONNECTORS (J1.52), [13] - ETHERNET PHY (U8.11)
TRD3_P: [03] - CONNECTORS (J1.54), [13] - ETHERNET PHY (U8.10)

## Assembly variants
Prototype: not fitted FB8 Q5 Q8 Q9 R24 R51 R53 R54 R58 R65 R71 R77 R79 R87 R103 R105 R111 R117 R118 R120 R131 R133 R135 R137 R141 R142 R155 R156 R157